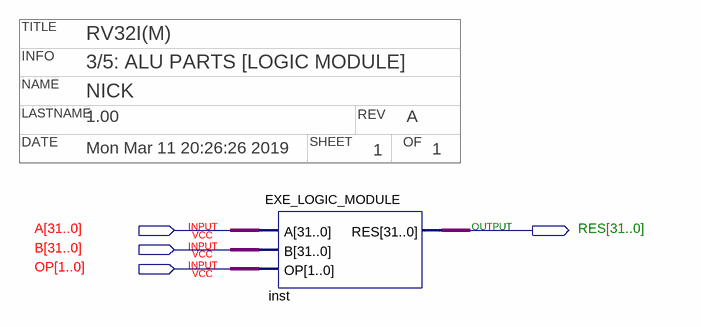
[diagram p0: schematic sheet]
// Quartus schematic EXE_LOGIC_MODULETEST.bdf as structural Verilog: 1 symbols, 4 pins
// Title block: TITLE: RV32I(M); INFO: 3/5: ALU PARTS [LOGIC MODULE]; NAME: NICK; LASTNAME: 1.00; REV: A; DATE: Mon Mar 11 20:26:26 2019; SHEET: 1; OF: 1
module EXE_LOGIC_MODULETEST (
  input  [31:0] A,
  input  [31:0] B,
  input  [1:0] OP,
  output [31:0] RES
);

  EXE_LOGIC_MODULE inst (.A(A), .B(B), .OP(OP), .RES(RES));
endmodule
